# EAGLE design Ext. Sense board (EAGLE 6.0)
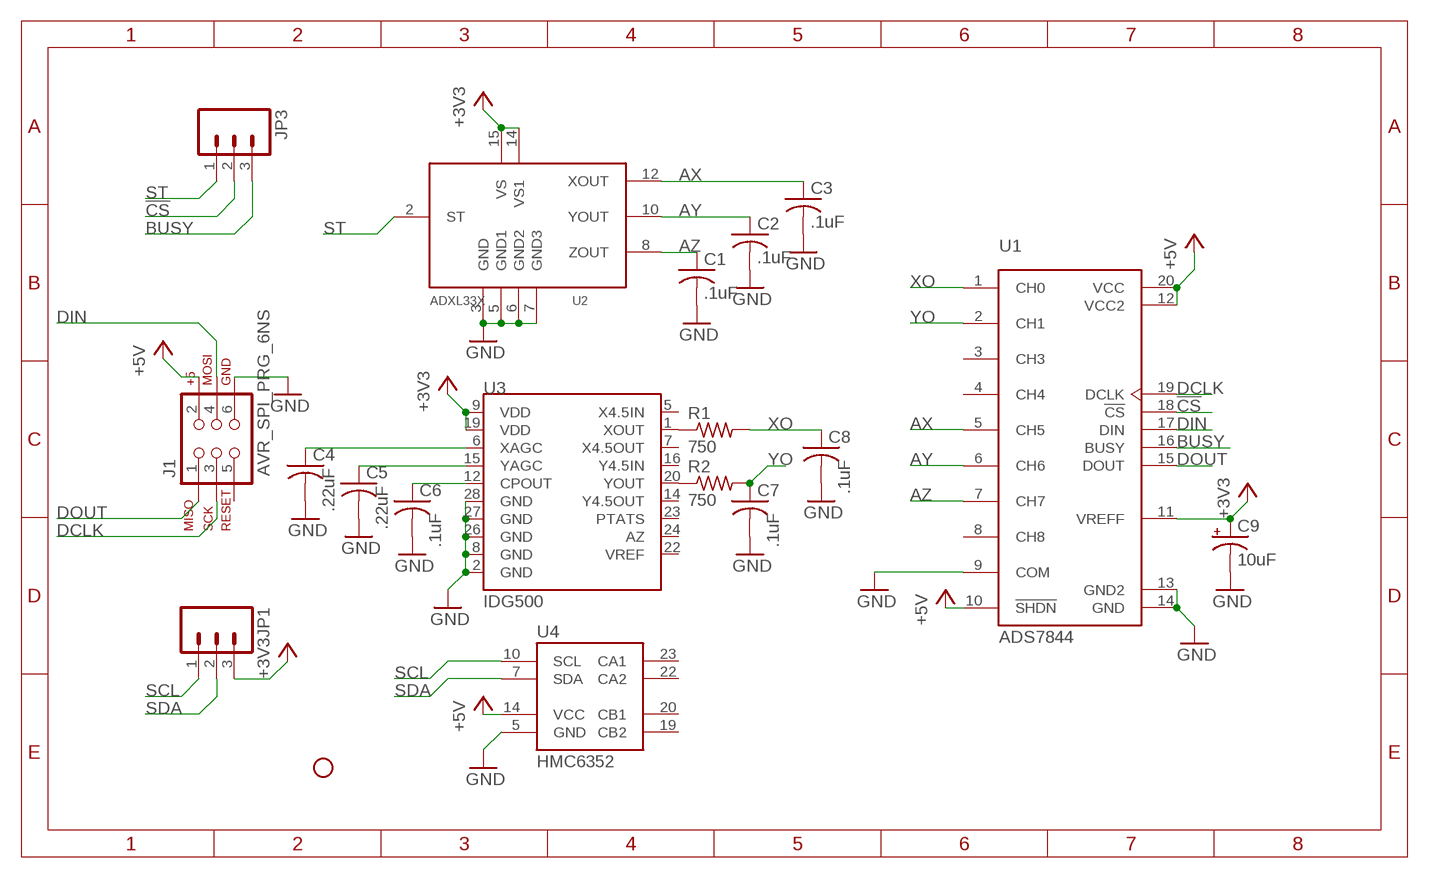
[diagram p0: schematic, sheet 1]

## Parts
C1  .1uF  C-USC0805  [C0805]
C2  .1uF  C-USC0805  [C0805]
C3  .1uF  C-USC0805  [C0805]
C4  .22uF  C-USC0805  [C0805]
C5  .22uF  C-USC0805  [C0805]
C6  .1uF  C-USC0805  [C0805]
C7  .1uF  C-USC0805  [C0805]
C8  .1uF  C-USC0805  [C0805]
C9  10uF  POLCAP  [POLC1206]
J1  AVR_SPI_PRG_6NS  [2X3-NS]
JP1  M031X03_NO_SILK  [1X03_NO_SILK]
JP2  STAND-OFF  [STAND-OFF]
JP3  M031X03_NO_SILK  [1X03_NO_SILK]
R1  750  R-US_R0805  [R0805]
R2  750  R-US_R0805  [R0805]
U1  ADS7844  [SSOP-20]
U2  ADXL33X  [16LCSP]
U3  IDG500  [SPARKFUN_IDG500]
U4  HMC6352  [LCC24]

## Nets
!CS: JP3.2 U1.18(!CS)
+3V3: C9.1(+) JP1.3 U1.11(VREFF) U2.14(VS1) U2.15(VS) U3.9(VDD) U3.19(VDD)
+5V: J1.2 U1.10(!SHDN) U1.12(VCC2) U1.20(VCC) U4.14(VCC)
AX: C3.1 U1.5(CH5) U2.12(XOUT)
AY: C2.1 U1.6(CH6) U2.10(YOUT)
AZ: C1.1 U1.7(CH7) U2.8(ZOUT)
BUSY: JP3.3 U1.16(BUSY)
DCLK: J1.3 U1.19(DCLK)
DIN: J1.4 U1.17(DIN)
DOUT: J1.1 U1.15(DOUT)
GND: C1.2 C2.2 C3.2 C4.2 C5.2 C6.2 C7.2 C8.2 C9.2(-) J1.6 U1.9(COM) U1.13(GND2) U1.14(GND) U2.3(GND) U2.5(GND1) U2.6(GND2) U2.7(GND3) U3.2(GND) U3.8(GND) U3.26(GND) U3.27(GND) U3.28(GND) U4.5(GND)
N$2: C4.1 U3.6(XAGC)
N$3: C5.1 U3.15(YAGC)
N$4: C6.1 U3.12(CPOUT)
N$5: R1.1 U3.1(XOUT)
N$6: R2.1 U3.20(YOUT)
SCL: JP1.1 U4.10(SCL)
SDA: JP1.2 U4.7(SDA)
ST: JP3.1 U2.2(ST)
XO: C8.1 R1.2 U1.1(CH0)
YO: C7.1 R2.2 U1.2(CH1)
Unconnected: J1.5 U1.3(CH3) U1.4(CH4) U1.8(CH8) U3.5(X4.5IN) U3.7(X4.5OUT) U3.14(Y4.5OUT) U3.16(Y4.5IN) U3.22(VREF) U3.23(PTATS) U3.24(AZ) U4.19(CB2) U4.20(CB1) U4.22(CA2) U4.23(CA1)

## Library data of the parts
C1-C8 = adafruit:C-US: CAPACITOR, American symbol
C9 = NASA_LIB:POLCAP
J1 = SparkFun:AVR_SPI_PRG_6: AVR ISP 6 Pin This is the reduced ISP connector for AVR programming. Common on Arduino. This footprint will take up less PCB space and can be used with a 10-pin to 6-pin adapter such as SKU: BOB-08508
JP1 JP3 = SparkFun:M03: Header 3 Standard 3-pin 0.1" header. Use with straight break away headers (SKU : PRT-00116), right angle break away headers (PRT-00553), swiss pins (PRT-00743), machine pins (PRT-00117), and female headers (PRT-00115). Molex polarized connector foot print use with SKU : PRT-08232 with associated crimp pins and housings.
JP2 = SparkFun:STAND-OFF: Stand Off This is the mechanical footprint for a #4 phillips button head screw. Use the keepout ring to avoid running the screw head into surrounding components. SKU : PRT-00447
R1 R2 = adafruit:R-US_: RESISTOR, American symbol
U1 = NASA_LIB:ADS7844
U2 = adafruit:ADXL33X
U3 = SparkFun:IDG500
U4 = SparkFun:HMC6352: HMC6352 This is the compass module from Honeywell. Works very well. Schematic and footprint are production proven. Spark Fun Electronics SKU : COM-07892

## Board
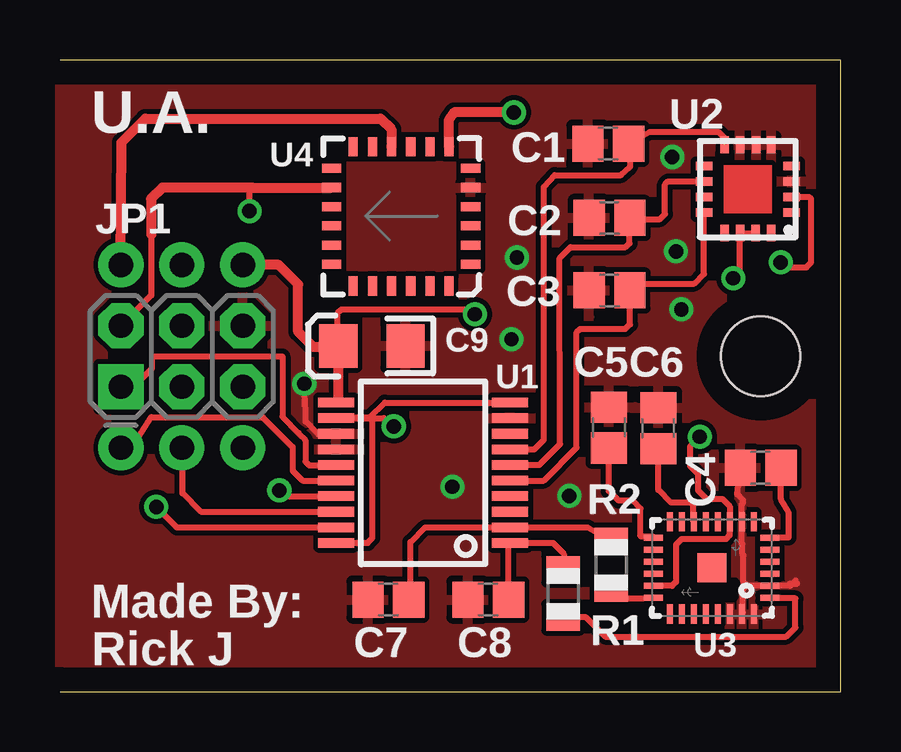
[diagram p1: board, top side]
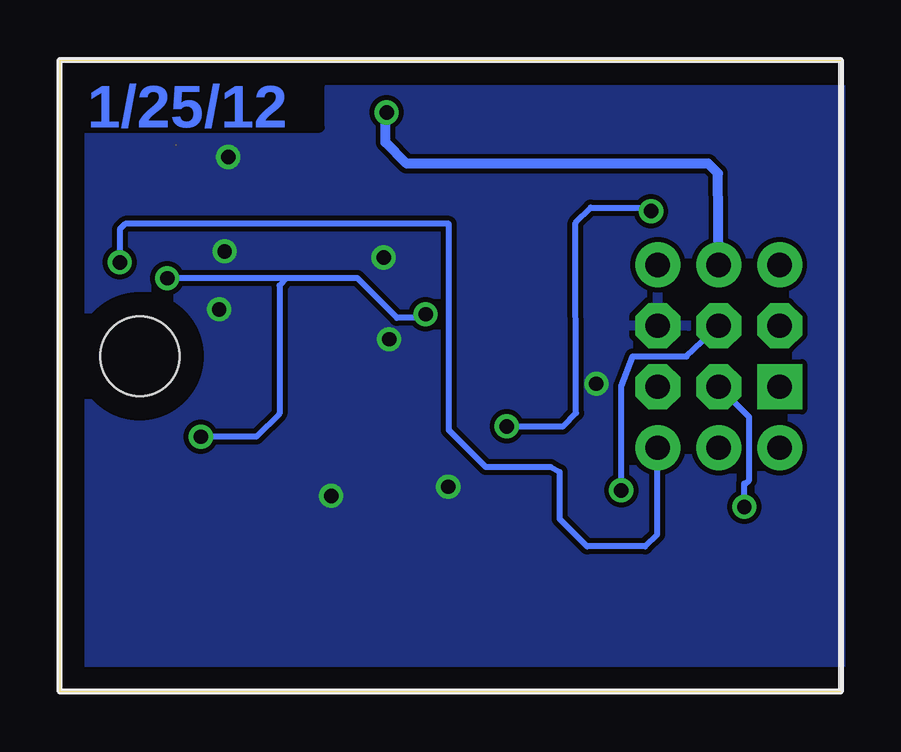
[diagram p2: board, bottom side, seen from below]

Size 32.54 x 26.31 mm. Coordinates in mm from the lower left corner, seen from the top.
Outline: 0,0 32.54,0 32.54,26.32 0,26.32
Copper layers (1*16): Top 0.035mm / dielectric 1.5mm / Bottom 0.035mm
Design rules: minimum track width 10mil, minimum drill 24mil, track to track 8mil, track to pad 8mil, pad to pad 8mil, via to via 8mil, smd to smd 8mil, copper to edge 40mil, drill to drill 8mil, minimum pad ring 10mil, minimum via ring 8mil, stop-mask expansion 4mil, vias tented up to drill 0mil, thermal gap 10mil
tRestrict: area 27.6,3.9 to 28.1,4.5

### Footprints (pad centres in the part's own frame; a part is rotated, then mirrored left to right if it is on the bottom)
C0805 = smd 1.3 x 1.5: 1 -0.85,0; 2 0.85,0
POLC1206 = smd 1.6 x 1.8: 1 -1.4,0; 2 1.4,0
2X3-NS = drill 1.016 pad 1.88 square: 1 -2.54,-1.27 | drill 1.016 pad 1.88 octagon: 2 -2.54,1.27; 3 0,-1.27; 4 0,1.27; 5 2.54,-1.27; 6 2.54,1.27
1X03_NO_SILK = drill 1.016 pad 1.88: 1 0,0; 2 2.54,0; 3 5.08,0
STAND-OFF = hole 3.302: 0,0
R0805 = smd 1.1 x 1.4: 1 -1,0; 2 1,0
SSOP-20 = smd 0.4 x 1.5: 1 -2.925,-3.625; 2 -2.275,-3.625; 3 -1.625,-3.625; 4 -0.975,-3.625; 5 -0.325,-3.625; 6 0.325,-3.625; 7 0.975,-3.625; 8 1.625,-3.625; 9 2.275,-3.625; 10 2.925,-3.625; 11 2.925,3.625; 12 2.275,3.625; 13 1.625,3.625; 14 0.975,3.625; 15 0.325,3.625; 16 -0.325,3.625; 17 -0.975,3.625; 18 -1.625,3.625; 19 -2.275,3.625; 20 -2.925,3.625
16LCSP = smd 0.7 x 0.35: 1 -1.825,0.975; 2 -1.825,0.325; 3 -1.825,-0.325; 4 -1.825,-0.975; 9 1.825,-0.975; 10 1.825,-0.325; 11 1.825,0.325; 12 1.825,0.975 | smd 0.35 x 0.7: 5 -0.975,-1.85; 6 -0.35,-1.85; 7 0.325,-1.85; 8 0.975,-1.85; 13 0.975,1.825; 14 0.325,1.825; 15 -0.325,1.825; 16 -0.975,1.825
SPARKFUN_IDG500 = smd 0.8 x 0.25: 1 -2.417,1.25; 2 -2.417,0.75; 3 -2.417,0.25; 4 -2.417,-0.25; 5 -2.417,-0.75; 6 -2.417,-1.25; 15 2.433,-1.25; 16 2.433,-0.75; 17 2.433,-0.25; 18 2.433,0.25; 19 2.433,0.75; 20 2.433,1.25 | smd 0.25 x 0.8: 7 -1.742,-1.925; 8 -1.242,-1.925; 9 -0.742,-1.925; 10 -0.242,-1.925; 11 0.258,-1.925; 12 0.758,-1.925; 13 1.258,-1.925; 14 1.758,-1.925; 21 1.758,1.925; 22 1.258,1.925; 23 0.758,1.925; 24 0.258,1.925; 25 -0.242,1.925; 26 -0.742,1.925; 27 -1.242,1.925; 28 -1.742,1.925 | smd 1.2 x 1.2: NC 0,0
LCC24 = smd 0.8 x 0.38: 1 -2.9,2.01; 2 -2.9,1.21; 3 -2.9,0.41; 4 -2.9,-0.39; 5 -2.9,-1.19; 6 -2.9,-1.99; 13 2.9,-1.99; 14 2.9,-1.19; 15 2.9,-0.39; 16 2.9,0.41; 17 2.9,1.21; 18 2.9,2.01 | smd 0.38 x 0.8: 7 -2,-2.89; 8 -1.2,-2.89; 9 -0.4,-2.89; 10 0.4,-2.89; 11 1.2,-2.89; 12 2,-2.89; 19 2,2.91; 20 1.2,2.91; 21 0.4,2.91; 22 -0.4,2.91; 23 -1.2,2.91; 24 -2,2.91

### Placement (x,y rotation side)
C1  22.86,22.83 180 top
C2  22.91,19.74 180 top
C3  22.91,16.71 180 top
C4  29.21,9.32 180 top
C5  22.89,11 90 top
C6  24.94,10.97 90 top
C7  13.69,3.84 180 top
C8  17.86,3.84 180 top
C9  13,14.4 0 top
J1  5.08,13.97 0 top
JP1  2.54,17.78 0 top
JP2  29.21,13.97 0 top
JP3  7.62,10.16 180 top
R1  20.98,4.09 90 top
R2  22.99,5.28 90 top
U1  15.14,9.12 90 top
U2  28.68,20.93 180 top
U3  27.18,5.16 180 top
U4  14.22,19.81 180 top

### Tracks (layer width: path | path; a pad name or v marks a point on that pad's centre or on a via)
!CS
  Top 0.254: U1.18 5.87,7.49 5.11,8.26 5.11,9.37 JP3.2
+3V3  (via drill 0.6)
  Top 0.254: U2.15 U2.14 28.35,17.51 v28.07,17.22 | v17.3,15.72 17.27,15.72 17.07,15.93 11.73,15.93 11.58,15.77 11.58,14.42 C9.1 | U3.19 25.51,4.41 25.68,4.57 25.68,6.12 25.91,6.35 27.76,6.35 27.91,6.5 U3.9 27.92,7.72 27.61,8.03 26.95,8.03 26.59,8.38 26.59,9.07 26.26,9.4 26.26,10.21 v26.67,10.62
  Top 0.406: U1.11 11.61,12.13 C9.1 11.55,14.35 10.57,14.35 9.93,14.99 9.93,16.97 9.12,17.78 JP1.3
  Bottom 0.254: 23.09,17.22 20.14,17.22 18.49,15.57 17.45,15.57 v17.3,15.72 | 23.09,17.22 v28.07,17.22 | v26.67,10.62 24.36,10.62 23.39,11.58 23.39,16.92 23.09,17.22
+5V  (via drill 0.6)
  Top 0.254: U1.20 12.82,6.19 13.03,6.4 13.03,11.28 12.9,11.4 | 12.9,11.4 11.52,11.4 U1.12 13.5,11.39 v13.92,11.05 | U1.10 13.54,12.04 12.9,11.4 | v7.9,20.02 7.9,20.88 8.03,21 | 3.81,19.05 3.81,16.51 J1.2
  Top 0.406: U4.14 8.03,21 4.26,21 3.79,20.52 3.81,20.52 3.81,19.05
  Bottom 0.254: v13.92,11.05 11.58,11.05 11.02,11.61 11.05,19.53 10.41,20.17 8.05,20.17 v7.9,20.02
AX
  Top 0.254: U2.12 26.85,17.4 26.44,16.99 23.81,16.99 C3.1 23.76,15.3 23.57,15.11 21.69,15.11 21.54,14.96 21.54,10.16 20.17,8.79 U1.5
AY
  Top 0.254: U2.10 25.34,21.25 25.22,21.13 25.22,19.89 25.02,19.68 23.79,19.68 C2.1 23.75,19.65 23.75,18.67 23.57,18.52 21.29,18.52 20.83,18.06 20.85,10.31 19.98,9.44 U1.6
AZ  (1 unrouted)
  Top 0.254: U1.7 19.77,10.09 20.17,10.49 20.17,21.03 20.62,21.51 23.39,21.51 23.77,21.87 23.77,22.36 C1.1 24.59,23.32 27.46,23.32 27.69,23.09 27.69,22.81 U2.8
BUSY
  Top 0.254: JP3.3 2.62,9.55 3.81,11.43 8.46,11.43 9.7,10.19 9.7,9.2 10.11,8.79 U1.16
DCLK  (via drill 0.6)
  Top 0.254: U1.19 4.87,6.84 v4.01,7.7
  Bottom 0.254: v4.01,7.7 4.01,8.66 3.96,8.66 3.81,8.81 3.81,11.43 4.45,12.06 J1.3
DIN  (via drill 0.6)
  Top 0.254: U1.17 9.54,8.14 v9.14,8.38
  Bottom 0.254: v9.14,8.38 9.14,12.72 8.66,13.97 6.43,13.97 J1.4
DOUT
  Top 0.254: J1.1 2.56,12.19 3.83,13.46 3.83,13.89 3.91,13.97 9.27,13.97 9.27,11.46 9.96,10.77 9.96,10.74 10.24,10.46 10.24,9.58 10.39,9.42 11.49,9.42 U1.15
GND  (via drill 0.6)
  Top 0.254: U3.2 30.44,4.41 30.66,4.62 30.66,4.57 30.73,4.5 30.43,4.5 30.35,4.42 28.63,4.42 | 28.63,4.42 28.47,4.27 28.47,3.29 U3.27 | C4.2 28.23,8.22 28.47,7.98 28.47,7.87 28.42,7.77 U3.8 | U3.8 | U3.8 28.42,6.17 28.45,6.15 28.45,5.71 28.5,5.66 28.5,4.55 28.63,4.42 | U1.13 10.77,10.72 10.24,11.25 10.24,11.66 v10.19,12.83
  other vias: 25.53,22.28 25.68,18.34 25.91,15.93 16.36,8.53 21.23,8.15 18.82,14.68 19.05,18.08
  pour Bottom: 0,26.42 32.54,26.37 32.54,-0.05 0,0
  pour Top: 0,26.42 32.54,26.37 32.54,-0.05 0,0
N$2
  Top 0.254: C4.1 30.06,8.02 30.38,7.47 30.38,6.43 29.61,6.43 U3.6
N$3
  Top 0.254: C5.1 22.89,8.36 23.29,7.95 23.88,7.95 24.21,7.62 24.21,6.48 24.23,6.45 24.7,6.45 U3.15
N$4
  Top 0.254: C6.1 24.94,8.41 25.48,7.87 26.31,7.87 26.42,7.77 U3.12
N$5
  Top 0.254: R1.1 21.93,3.09 22.73,2.29 30.28,2.29 30.66,2.67 30.66,3.89 29.65,3.89 U3.1
N$6
  Top 0.254: R2.1 23.2,4.33 23.65,3.89 24.31,3.89 U3.20
SCL
  Top 0.406: JP1.1 2.56,22.89 3.56,23.88 13.36,23.88 13.82,23.42 U4.10
SDA  (via drill 0.6)
  Top 0.406: v18.92,24.13 16.43,24.13 16.2,23.8 16.2,22.72 U4.7
  Bottom 0.406: JP1.2 5.11,21.59 5.51,22 18.09,22 18.97,22.89 18.97,24.13 v18.92,24.13
ST  (via drill 0.6)
  Top 0.254: U2.2 31.24,20.61 31.32,20.52 31.32,17.88 31.11,17.68 30.25,17.68 v30.05,17.88
  Bottom 0.254: v30.05,17.88 30.05,19.25 29.82,19.48 16.33,19.48 16.33,10.9 14.78,9.35 12.09,9.35 11.71,9.14 11.71,7.19 10.57,6.04 8.15,6.04 7.64,6.55 7.64,10.13 JP3.1
XO
  Top 0.254: C8.1 18.71,6.14 U1.1 20.55,6.19 21.01,5.74 21.01,5.12 R1.2
YO
  Top 0.254: C7.1 14.61,3.9 14.61,6.22 15.23,6.84 U1.2 22,6.84 R2.2

### Text on the board
Bottom: 1/25/12
tPlace: U4
_tsilk: U2 | U.A. | U4 | C1 | JP1 | C2 | C3 | C9 | U1 | C6 | C5 | C4 | R2 | Made By: | C7 | C8 | R1 | U3 | Rick J